# Altium project SmartHiveClient_220V_V2.0.PrjPcb
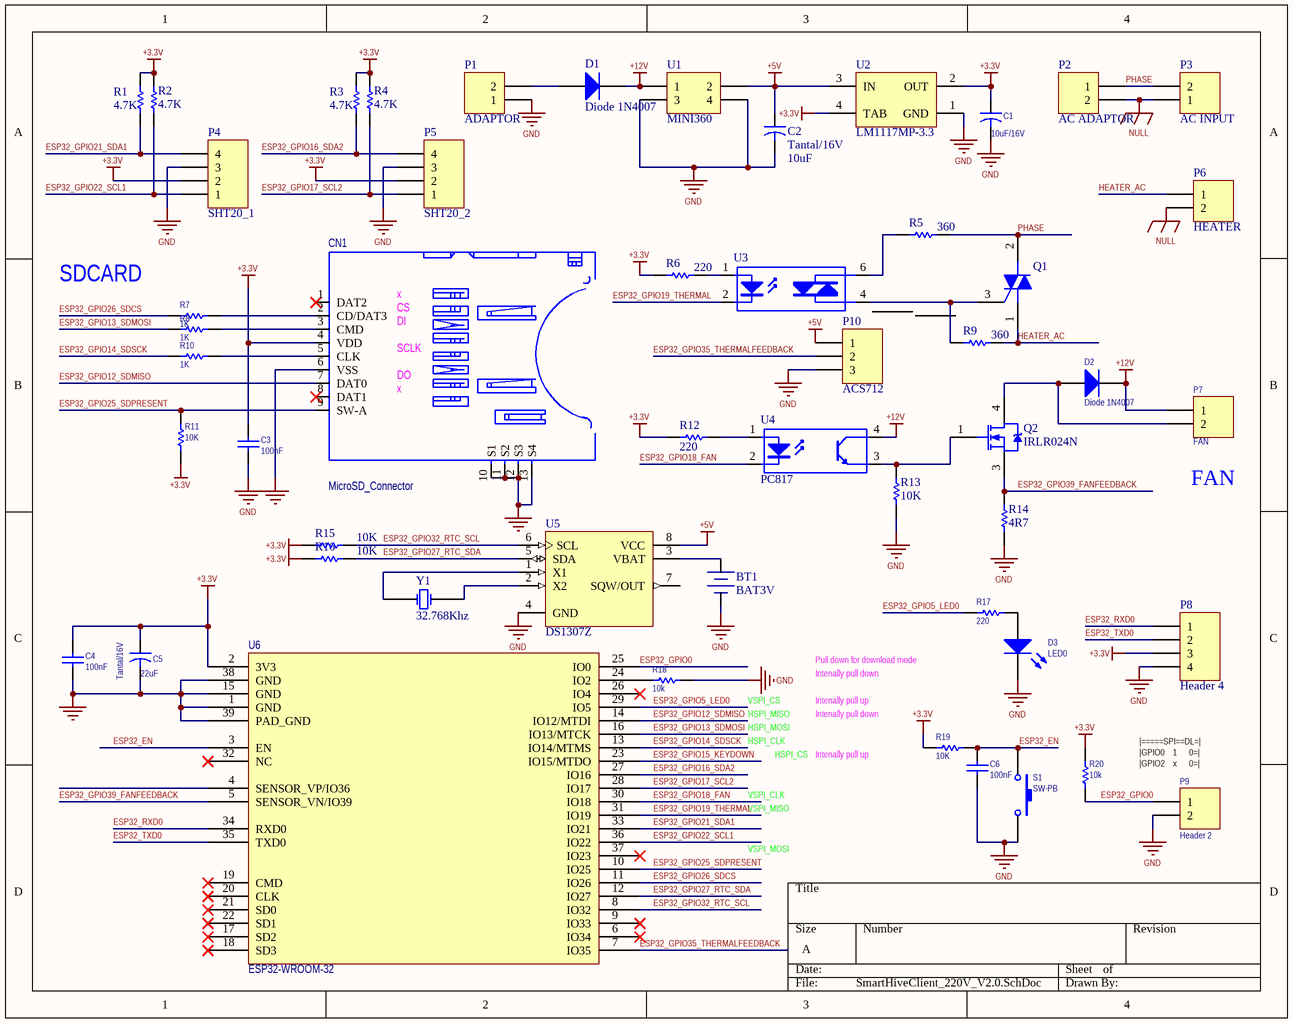
[diagram p0: SmartHiveClient_220V_V2.0.SchDoc]
1 sheet, 51 parts. Net scope: global (net labels, ports and power ports of the same name join across sheets).
Board file: SmartHiveClient_220V_V2.0.PcbDoc

## Sheet SmartHiveClient_220V_V2.0.SchDoc
size A

### Parts
BT1  BAT3V  [BTH2032_DIP]
C1  10uF/16V  [Cap electrolitic radial 5x11-2]
C2  Tantal/16V  value 10uF  [Cap electrolitic radial 5x11-2]
C3  100nF  [CAP0805]
C4  100nF  [CAP0805]
C5  Tantal/16V  value 22uF  [CAP_TANTAL_TYPE_B]
C6  100nF  [CAP0805]
CN1  MicroSD_Connector  [MICRO_SD_TFP-09-2-12B]
D1  Diode 1N4007  [DO-241AC]
D2  Diode 1N4007  [DO-241AC]
D3  LED0  [LED_0805]
P1  ADAPTOR  [KF301 2PIN]
P2  AC ADAPTOR  [KF301 2PIN]
P3  AC INPUT  [MSTB 2,5/2-G-5,08]
P4  SHT20_1  [XH-4PIN-RA]
P5  SHT20_2  [XH-4PIN-RA]
P6  HEATER  [MSTB 2,5/2-G-5,08]
P7  FAN  [MSTB 2,5/2-G-5,08]
P8  Header 4  [HDR1X4]
P9  Header 2  [Jumper Small - 2.54 - Black]
P10  ACS712  [HDR1X3]
Q1  BT139  [TO-220 AB WITH HEAT SINK]  (value not drawn)
Q2  IRLR024N  [TO252-3M]
R1  4.7K  [RES0805]
R2  4.7K  [RES0805]
R3  4.7K  [RES0805]
R4  4.7K  [RES0805]
R5  360  [RES1206]
R6  220  [RES0805]
R7  1K  [RES0805]
R8  1K  [RES0805]
R9  360  [RES1206]
R10  1K  [RES0805]
R11  10K  [RES0805]
R12  220  [RES0805]
R13  10K  [RES0805]
R14  4R7  [RES2512]
R15  10K  [RES0805]
R16  10K  [RES0805]
R17  220  [RES0805]
R18  10k  [RES0805]
R19  10K  [RES0805]
R20  10k  [RES0805]
S1  SW-PB  [SW-2PIN-SMD]
U1  MINI360  [MINI360-DCDC]
U2  LM1117MP-3.3  [SOT223_4]
U3  MOC3063  [DIP-6]  (value not drawn)
U4  PC817  [DIP_4]
U5  DS1307Z  [SO-8N]
U6  ESP32-WROOM-32  [ESP32-WROOM-32D]
Y1  32.768Khz  [Crystal_NC308]

### Nets
+3.3V: C1.1 C3.2 C4.2 C5.1 CN1.4(VDD) P4.2 P5.2 P8.3 R1.2 R2.2 R3.2 R4.2 R6.2 R11.2 R12.1 R15.2 R16.2 R19.2 R20.2 U2.2(OUT) U2.4(TAB) U6.2(3V3)
+5V: C2.1 P10.1 U1.2 U2.3(IN) U5.8(VCC)
+12V: D1.2(K) D2.2(K) P7.1 U1.1 U4.4(C)
GND: BT1.2(-) C1.2 C2.2 C3.1 C4.1 C5.2 C6.1 CN1.6(VSS) CN1.10(S1) CN1.11(S2) CN1.12(S3) CN1.13(S4) D3.2(K) P1.1 P4.3 P5.3 P8.4 P9.2 P10.3 R13.1 R14.1 R18.1 S1.2 U1.3 U1.4 U2.1(GND) U5.4(GND) U6.1(GND) U6.15(GND) U6.38(GND) U6.39(PAD_GND)
NULL: P2.2 P3.1 P6.2
ESP32_EN: C6.2 R19.1 S1.1 U6.3(EN)
ESP32_GPIO0: P9.1 R20.1 U6.25(IO0)
ESP32_GPIO5_LED0: R17.1 U6.29(IO5)
ESP32_GPIO12_SDMISO: CN1.7(DAT0) U6.14(IO12/MTDI)
ESP32_GPIO13_SDMOSI: R8.2 U6.16(IO13/MTCK)
ESP32_GPIO14_SDSCK: R10.2 U6.13(IO14/MTMS)
ESP32_GPIO15_KEYDOWN: U6.23(IO15/MTDO)
ESP32_GPIO16_SDA2: P5.4 R3.1 U6.27(IO16)
ESP32_GPIO17_SCL2: P5.1 R4.1 U6.28(IO17)
ESP32_GPIO18_FAN: U4.2(K) U6.30(IO18)
ESP32_GPIO19_THERMAL: U3.2(K) U6.31(IO19)
ESP32_GPIO21_SDA1: P4.4 R1.1 U6.33(IO21)
ESP32_GPIO22_SCL1: P4.1 R2.1 U6.36(IO22)
ESP32_GPIO25_SDPRESENT: CN1.9(SW-A) R11.1 U6.10(IO25)
ESP32_GPIO26_SDCS: R7.2 U6.11(IO26)
ESP32_GPIO27_RTC_SDA: R16.1 U5.5(SDA) U6.12(IO27)
ESP32_GPIO32_RTC_SCL: R15.1 U5.6(SCL) U6.8(IO32)
ESP32_GPIO35_THERMALFEEDBACK: P10.2 U6.7(IO35)
ESP32_GPIO39_FANFEEDBACK: Q2.3(S) R14.2 U6.5(SENSOR_VN/IO39)
ESP32_RXD0: P8.1 U6.34(RXD0)
ESP32_TXD0: P8.2 U6.35(TXD0)
HEATER_AC: P6.1 Q1.1(M1) R9.1
PHASE: P2.1 P3.2 Q1.2(M2) R5.1
NetBT1_1: BT1.1(+) U5.3(VBAT)
NetCN1_2: CN1.2(CD/DAT3) R7.1
NetCN1_3: CN1.3(CMD) R8.1
NetCN1_5: CN1.5(CLK) R10.1
NetD1_1: D1.1(A) P1.2
NetD2_1: D2.1(A) P7.2 Q2.4(D)
NetD3_1: D3.1(A) R17.2
NetQ1_3: Q1.3(G) R9.2 U3.4(A/K)
NetQ2_1: Q2.1(G) R13.2 U4.3(E)
NetR5_2: R5.2 U3.6(A/K)
NetR6_1: R6.1 U3.1(A)
NetR12_2: R12.2 U4.1(A)
NetR18_2: R18.2 U6.24(IO2)
NetU5_1: U5.1(X1) Y1.1(OSC1)
NetU5_2: U5.2(X2) Y1.2(OSC2)

Not connected (* = marked no-connect by the designer): CN1 1(DAT2)* 8(DAT1)*; U3 3(NC) 5(NC); U5 7(SQW/OUT); U6 4(SENSOR_VP/IO36) 6(IO34)* 9(IO33)* 17(SD2)* 18(SD3)* 19(CMD)* 20(CLK)* 21(SD0)* 22(SD1)* 26(IO4)* 32(NC)* 37(IO23)*

### Notes on the sheet
- SDCARD
- (near CN1) x
- (near CN1) CS
- (near CN1) DI
- (near CN1) SCLK
- (near CN1) DO
- (near P7) FAN
- VSPI_CS
- Intenally pull down
- Pull down for download mode
- Intenally pull up
- HSPI_MOSI
- HSPI_MISO
- HSPI_CLK
- HSPI_CS
- (near R19) Intenally pull down
- (near R19) Intenally pull up
- (near P9) |=====SPI==DL=|
  |GPIO0    1      0=|
  |GPIO2    x      0=|
  |=============|
- VSPI_MISO
- VSPI_CLK
- VSPI_MOSI

### Library data of the parts
BT1 = Battry Backup: Designer: Abbas Basereh; Data: 16-12-2016; Link: *; Part. No: *
C1 C2 C5 = Cap2: Capacitor; Published: 23-Sep-2002; PackageReference: CAPR5-4X5; Publisher: Altium Limited; PackageDescription: Capacitor; 2 Leads
  C1: Value: 10uF/16V
C3 C4 C6 = Cap: Capacitor; Published: 8-Jun-2000; LatestRevisionDate: 17-Jul-2002; LatestRevisionNote: Re-released for DXP Platform.; PackageReference: RAD-0.3; Publisher: Altium Limited; PackageDescription: Radial Cap, Thru-Hole; 2 Leads; 0.3 in Pin Spacing; Value: 100nF
D1 D2 = Diode 1N4007: 1 Amp General Purpose Rectifier; Published: 8-Jun-2000; LatestRevisionDate: 17-Jul-2002; LatestRevisionNote: Re-released for DXP Platform.; DatasheetVersion: 1998; PackageVersion: Aug-1999; PackageReference: DO-41; Publisher: Altium Limited; PackageDescription: Diode, Axial; Body 5.2 x 2.7 mm (LxDia. max), Lead Dia. 0.86 mm (max); Code_JEDEC: DO-204-AL; ComponentLink1Description: Manufacturer Link; ComponentLink1URL: http://www.fairchildsemi.com/; ComponentLink2Description: Datasheet; ComponentLink2URL: http://www.fairchildsemi.com/ds/1N%2F1N4001.pdf
D3 = LED0: Typical INFRARED GaAs LED; Published: 8-Jun-2000; LatestRevisionDate: 08-Jul-2005; LatestRevisionNote: Mech Layer 1 removed.; PackageReference: LED-0; Publisher: Altium Limited; PackageDescription: LED; 2 Leads
P1-P3 P6 P7 P9 = Header 2: Header, 2-Pin; LatestRevisionDate: 17-Jul-2002; LatestRevisionNote: Re-released for DXP Platform.; Publisher: Altium Limited
P4 P5 P8 = Header 4: Header, 4-Pin; LatestRevisionDate: 17-Jul-2002; LatestRevisionNote: Re-released for DXP Platform.; Publisher: Altium Limited
P10 = Header 3: ACS712 CURRENT; LatestRevisionDate: 17-Jul-2002; LatestRevisionNote: Re-released for DXP Platform.; Publisher: Altium Limited
Q1 = Triac: Silicon Bidirectional Triode Thyristor; Note: Pin 2 is electrically connected to Pin 4 (TAB); Published: 29-Sep-2000; LatestRevisionDate: 17-Jul-2002; LatestRevisionNote: Re-released for DXP Platform.; DatasheetVersion: 1999; PackageReference: 369-03; Publisher: Altium Limited; PackageDescription: TO, Thru-Hole, Vertical, Heatsink Mounted; 3 In-Line Leads; Pitch 2.28 mm; ComponentLink1Description: Manufacturer Link; ComponentLink1URL: http://www.motorola.com/
Q2 = IRLR024N: HEXFET Power MOSFET; Note: Pin 2 is trimmed and is electrically connected to Drain.; Published: 8-Jun-2000; LatestRevisionDate: 20-Nov-2009; LatestRevisionNote: IPC-7351 Footprint Added.; PackageVersion: Feb-2003; PackageReference: TO-252AA; Publisher: Altium Limited; PackageDescription: 3-Pin HEXFET Package 2.28 mm Pitch, 9.9 mm Lead Span; Code_JEDEC: TO-252-AA; ComponentLink1Description: Manufacturer Link; ComponentLink1URL: http://www.irf.com/; ComponentLink2Description: Datasheet; ComponentLink2URL: http://www.irf.com/product-info/datasheets/data/irlr024n.pdf
R1-R13 R15-R20 = Res1: Resistor; Published: 8-Jun-2000; LatestRevisionDate: 17-Jul-2002; LatestRevisionNote: Re-released for DXP Platform.; PackageReference: AXIAL-0.3; Publisher: Altium Limited; PackageDescription: Axial Device, Thru-Hole; 2 Leads; 0.3 in Pin Spacing
  R1-R4: Value: 4.7K
  R5 R9: Value: 360
  R6 R12 R17: Value: 220
  R7 R8 R10: Value: 1K
  R11 R13 R15 R16 R19: Value: 10K
  R18 R20: Value: 10k
R14 = Res1: Size:2512,1%; Published: 8-Jun-2000; LatestRevisionDate: 17-Jul-2002; LatestRevisionNote: Re-released for DXP Platform.; PackageReference: AXIAL-0.3; Publisher: Altium Limited; PackageDescription: Axial Device, Thru-Hole; 2 Leads; 0.3 in Pin Spacing; Value: 4R7
S1 = SW-PB: Switch; Published: 24-Mar-1999; LatestRevisionDate: 17-Jul-2002; LatestRevisionNote: Re-released for DXP Platform.; PackageReference: SPST-2; Publisher: Altium Limited; PackageDescription: Switch; 2 Leads
U1 = Header 2X2: LatestRevisionDate: 17-Jul-2002; LatestRevisionNote: Re-released for DXP Platform.; Publisher: Altium Limited
U2 = LM1117MP-3.3: 800mA Low-Dropout Linear Regulator, 4-pin SOT-223; Manufacturer: National Semiconductor; PackageTopMarking: XYTT*N05A; PowerWise: N; CompType: LDO IC; Published: 4-Dec-2008; DatasheetVersion: Apr-2006; PackageVersion: revB, Apr-2003; PackageReference: MP04A; Publisher: Altium Limited; PackageDescription: Molded SOT-223, 6.50 x 3.56 x 1.6mm Body, 4 Lead, 2.3mm Pitch; Supplier 1: Farnell; Supplier Part Number 1: 9778195; Supplier 2: Farnell; Supplier Part Number 2: 9778195RL; PartNumber: LM1117MP-3.3; RoHS: N; PinCount: 4; Code_JEDEC: TO-261-AA; Code_IPC: SOT223-4; ComponentLink1Description: LM1117 Datasheet; ComponentLink1URL: http://www.national.com/ds/LM/LM1117.pdf; ComponentLink2Description: LM1117 Web Page; ComponentLink2URL: http://www.national.com/pf/LM/LM1117.html; ComponentLink3Description: MP04A Package Page; ComponentLink3URL: http://www.national.com/packaging/folders/mp04a.html
U3 = Opto TRIAC: Opto-Triac; Published: 24-Mar-1999; LatestRevisionDate: 17-Jul-2002; LatestRevisionNote: Re-released for DXP Platform.; PackageReference: NPSIP4A; Publisher: Altium Limited; PackageDescription: SIP; 4 Leads; Body 10 x 11.5 x 7.5 mm (typ); Pitch 2.54 mm
U4 = Optoisolator1: 4-Pin Phototransistor Optocoupler; Published: 24-Mar-1999; LatestRevisionDate: 04-Mar-2005; LatestRevisionNote: Sch pins 3 & 4 Swapped.; DatasheetVersion: Nov-2003; PackageReference: DIP-4; Publisher: Altium Limited
U5 = DS1307Z: 64 X 8 Serial Real-Time Clock; Published: 13-Oct-2000; LatestRevisionDate: 13-Apr-2006; LatestRevisionNote: IPC-7351 Footprint Added.; DatasheetVersion: 10-Aug-1999; PackageVersion: 1999; PackageReference: SOIC8N; Publisher: Altium Limited; PackageDescription: 8-Pin Small Outline Integrated Circuit 1.27 mm Pitch; Code_IPC: SOIC127P600-8; ComponentLink1Description: Manufacturer Link; ComponentLink1URL: http://www.maxim-ic.com/; ComponentLink2Description: Datasheet; ComponentLink2URL: http://pdfserv.maxim-ic.com/en/ds/DS1307.pdf; ComponentLink3Description: Discontinuation Notice; ComponentLink3URL: http://www.maxim-ic.com/qa/pdfs/non-obsolescence-letter.pdf
U6 = ESP32-WROOM-32: ESP32  a single chip 2.4 GHz Wi-Fi and Bluetooth combo chip
Y1 = XTAL_Crystal: XTAL Crystal; Designer: ABBAS BASEREH; Design Date: 2017-1-3; ComponentLink1Description: Datasheet; ComponentLink2Description: Reference; Mounting Technology: Surface Mount\Through-Hole; Value: 32.768Khz; Status: Unreleased